# EasyEDA Pro project OV-Watch_V2.4_LCProject_2024-05-25.epro, board Core
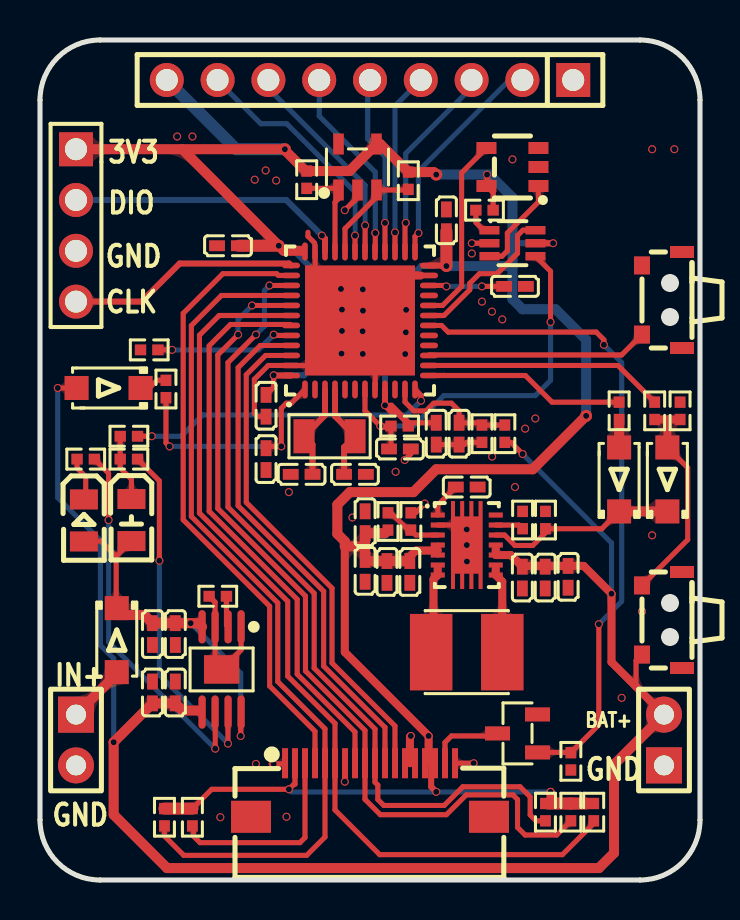
[diagram p4: board, top side]
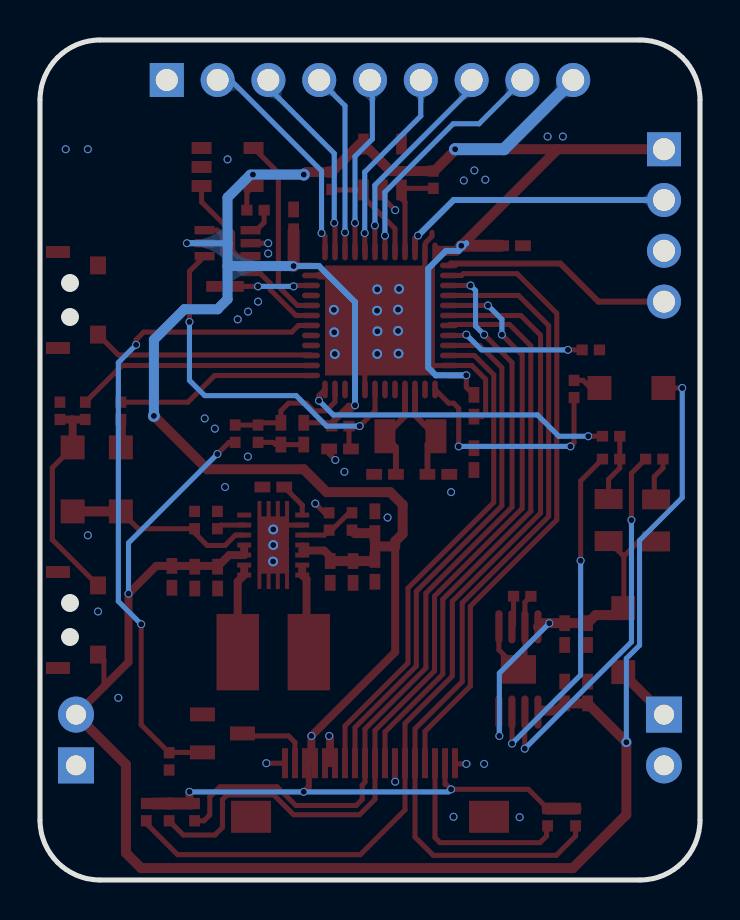
[diagram p5: board, bottom side, seen from below]

Outline 33 x 42 mm; copper layers: Top Layer, Bottom Layer. Coordinates in mm from the lower left corner of the outline.
Outline path: 0,39 0,3 arc(0.88,0.88) 3,0 30,0 arc(32.12,0.88) 33,3 33,39 arc(32.12,41.12) 30,42 3,42 arc(0.88,41.12) 0,39
Stack: Top Layer 0.035mm / Dielectric1 1.51mm FR4 er 4.5 / Bottom Layer 0.035mm

## Design rules (mm)
template: 用户自定义配置
spacing safeClearance (default): track to track 0.152, other pairs 0.152 to 0.3
track width trackWidth (default): min 0.127, default 0.254, max 2.54
differential pair differentialPair (default): width min 0.127, default 0.254, max 2.54; gap min 0.152, default 0.152
via viaSize (default): diameter min 0.4, default 0.4, max 10; hole min 0.3, default 0.3, max 6

## Placement (name value [footprint] x y rotation side)
C1  100nF  [C0402]  11.3 21.05 90 top
C2  100nF  [C0402]  18 21.55 180 top
C3  7pF  [C0402]  13.08 20.28 180 top
C4  7pF  [C0402]  15.75 20.28 0 top
C5  4.7uF  [C0402]  23.75 29.68 0 top
C9  22uF  [C0402]  16.26 17.89 90 top
C10  22uF  [C0402]  18.49 15.4 270 top
C11  22uF  [C0402]  17.35 15.4 270 top
C12  22uF  [C0402]  16.26 15.46 270 top
C13  100nF  [C0402]  21.34 19.65 0 top
C14  10uF  [C0402]  25.26 15.12 270 top
C15  10uF  [C0402]  26.41 15.16 270 top
C16  10uF  [C0402]  24.12 15.12 270 top
C17  10uF  [C0402]  6.77 12.3 270 top
C18  100nF  [C0402]  5.62 12.3 270 top
C19  10uF  [C0402]  5.62 9.38 90 top
C20  100nF  [C0402]  6.77 9.38 90 top
C21  100nF  [C0402]  20.96 22.31 270 top
C22  100nF  [C0402]  11.3 23.71 90 top
C23  100nF  [C0402]  20.32 32.98 270 top
C24  100nF  [C0402]  9.4 31.71 0 top
C25  100nF  [C0402]  19.81 22.31 90 top
D1  1N4007  [SOD-123FL_L2.8-W1.8-LS3.7-RD]  3.43 24.6 180 top
D4  1N4007  [SOD-123FL_L2.8-W1.8-LS3.7-RD]  31.37 20.03 90 top
D5  1N4007  [SOD-123FL_L2.8-W1.8-LS3.7-RD]  28.96 20.03 90 top
D7  A7  [SOD-123FL_L2.8-W1.8-LS3.7-RD]  3.84 11.99 270 top
H1  外接焊盘  [HDR-TH_2P-P2.54-V-M-1]  1.8 7 270 top
H2  外接电池  [HDR-TH_2P-P2.54-V-M-1]  31.2 7 90 top
H4  1125-1104G0S116C001  [HDR-TH_4P-P2.54-V-M-1]  1.8 32.73 270 top
H5  DZ254R-11-09-63  [HDR-TH_9P-P2.54-V-M]  16.5 40 180 top
L2  1.5uH  [IND-SMD_L4.0-W4.0_SWPA4018S]  21.34 11.39 180 top
LED1  SZYY0805R  [LED0805-R-RD]  4.57 18 270 top
LED2  NCD0805G1  [LED0805-R-RD]  2.2 17.98 270 top
R1  10K  [R0402]  6.3 24.55 270 top
R2  10K  [R0402]  17.98 22.7 180 top
R3  10K  [R0402]  5.46 26.51 0 top
R4  4.7K  [R0402]  6.22 3.14 90 top
R5  4.7K  [R0402]  7.62 3.14 90 top
R6  4.7K  [R0402]  27.69 3.39 90 top
R7  4.7K  [R0402]  26.54 3.39 90 top
R8  4.7K  [R0402]  25.27 3.39 90 top
R12  1M  [R0402]  17.4 17.93 270 top
R13  180K  [R0402]  18.54 17.93 270 top
R14  20K  [R0402]  30.73 23.46 90 top
R15  20K  [R0402]  32 23.46 270 top
R16  1M  [R0402]  25.27 18 270 top
R17  4.7K  [R0402]  28.96 23.46 90 top
R18  2K  [R0402]  4.44 21.05 0 top
R19  10K  [R0402]  2.29 21.05 0 top
R20  2K  [R0402]  4.44 22.19 180 top
R22  1.2K  [R0402]  8.89 14.19 180 top
R23  1M  [R0402]  23.24 22.31 270 top
R24  1M  [R0402]  22.1 22.31 90 top
R25  10K  [R0402]  26.54 5.93 90 top
R27  4.7kΩ  [R0402]  18.41 34.96 90 top
R28  4.7kΩ  [R0402]  13.34 35.02 90 top
R29  10K  [R0402]  22.22 33.49 180 top
R30  4.7K  [R0402]  24.13 18 270 top
SW1  -  [KEY-SMD_K2-1806SA-C3DW-04]  31.1 29 90 top
SW2  -  [KEY-SMD_K2-1806SA-C3DW-04]  31.1 13 90 top
U1  STM32F411CEU6  [UFQFPN-48_L7.0-W7.0-P0.50-BL-EP]  16 27.98 0 top
U2  2N7002  [SOT-23-3_L2.9-W1.3-P1.90-LS2.4-BR]  23.88 7.33 0 top
U4  TP4056M  [MSOP-8_L3.0-W3.0-P0.65-LS5.0-BL-EP]  9.08 10.53 180 top
U5  TPS63020DSJR  [VSON-14_L4.0-W3.0-P0.50-BL-EP_TI_DSJ]  21.34 16.75 270 top
U6  BL24C02F-RRRC  [TSOT-23-5_L2.9-W1.6-P0.95-LS2.8-BL]  15.88 35.65 0 top
U8  TPS3823-33DBVR  [SOT-23-5_L3.0-W1.7-P0.95-LS2.8-BR]  23.62 35.65 0 top
U9  BL1551B  [SC-70-6_L2.1-W1.3-P0.65-LS2.3-BR]  23.62 31.84 180 top
X1  -  [OSC-SMD_L3.2-W1.5]  14.48 22.19 0 top
X2  AFC01-S18FCA-00  [FPC-SMD_18P-P0.50_JS_AFC01-S18FCA-00]  16.5 4.5 0 top

## Footprints (pads in the part's own frame, mm; a bottom-side part is the same pattern mirrored in y, then rotated)
C0402
  rect 0.79x0.54 smd: 1(-0.545,0) 2(0.545,0)
FPC-SMD_18P-P0.50_JS_AFC01-S18FCA-00
  rect 0.3x1.5 smd: 1(-4.25,1.339) 2(-3.751,1.339) 3(-3.25,1.339) 4(-2.749,1.339) 5(-2.249,1.339) 6(-1.749,1.339) 7(-1.248,1.339) 8(-0.75,1.339) 9(-0.251,1.339) 10(0.25,1.339) 11(0.75,1.339) 12(1.251,1.339) 13(1.751,1.339) 14(2.251,1.339) 15(2.751,1.339) 16(3.25,1.339) 17(3.75,1.339) 18(4.25,1.339)
  rect 2x1.6 smd: 19(5.949,-1.339) 20(-5.949,-1.339)
HDR-TH_2P-P2.54-V-M-1
  rect 1.8x1.8 hole 1: 1(-1.27,0)
  round 1.8 hole 1: 2(1.27,0)
HDR-TH_4P-P2.54-V-M-1
  rect 1.7x1.7 hole 1.1: 1(-3.81,0)
  round 1.7 hole 1.1: 2(-1.27,0) 3(1.27,0) 4(3.81,0)
HDR-TH_9P-P2.54-V-M
  rect 1.7x1.7 hole 1.1: 1(-10.16,0)
  round 1.7 hole 1.1: 2(-7.62,0) 3(-5.08,0) 4(-2.54,0) 5(0,0) 6(2.54,0) 7(5.08,0) 8(7.62,0) 9(10.16,0)
IND-SMD_L4.0-W4.0_SWPA4018S
  rect 2.123x3.82 smd: 1(1.778,0) 2(-1.778,0)
KEY-SMD_K2-1806SA-C3DW-04
  rect 0.899x0.8 smd: 1(1.73,1.001) 2(-1.73,1.001)
  rect 0.6x1.199 smd: 3(2.401,-1.001) 4(-2.401,-1.001)
LED0805-R-RD
  rect 1x1.399 smd: 1(1.05,0) 2(-1.05,0)
MSOP-8_L3.0-W3.0-P0.65-LS5.0-BL-EP
  oval 0.364x1.662 smd: 1(-0.975,-2.131) 2(-0.325,-2.131) 3(0.325,-2.131) 4(0.975,-2.131) 5(0.975,2.131) 6(0.325,2.131) 7(-0.325,2.131) 8(-0.975,2.131)
  rect 1.76x1.425 smd: 9(0,0)
OSC-SMD_L3.2-W1.5
  rect 1.049x1.7 smd: 1(-1.275,0) 2(1.275,0)
R0402
  rect 0.566x0.54 smd: 1(-0.433,0) 2(0.433,0)
SC-70-6_L2.1-W1.3-P0.65-LS2.3-BR
  rect 1x0.42 smd: 1(1.15,-0.65) 2(1.15,0) 3(1.15,0.65) 4(-1.15,0.65) 5(-1.15,0) 6(-1.15,-0.65)
SOD-123FL_L2.8-W1.8-LS3.7-RD
  rect 1.2x1.2 smd: 1(-1.6,0) 2(1.6,0)
SOT-23-3_L2.9-W1.3-P1.90-LS2.4-BR
  rect 1.25x0.7 smd: 1(1,-0.95) 2(1,0.95) 3(-1,0)
SOT-23-5_L3.0-W1.7-P0.95-LS2.8-BR
  rect 1x0.6 smd: 1(1.3,-0.95) 2(1.3,0) 3(1.3,0.95) 4(-1.3,0.95) 5(-1.3,-0.95)
TSOT-23-5_L2.9-W1.6-P0.95-LS2.8-BL
  rect 0.531x1.044 smd: 1(-0.95,-1.148) 2(0,-1.148) 3(0.95,-1.148) 4(0.95,1.148) 5(-0.95,1.148)
UFQFPN-48_L7.0-W7.0-P0.50-BL-EP
  oval 0.28x0.899 smd: 1(-2.751,-3.45) 2(-2.251,-3.45) 3(-1.75,-3.45) 4(-1.25,-3.45) 5(-0.75,-3.45) 6(-0.249,-3.45) 7(0.249,-3.45) 8(0.75,-3.45) 9(1.25,-3.45) 10(1.75,-3.45) 11(2.251,-3.45) 12(2.751,-3.45) 25(2.751,3.45) 26(2.251,3.45) 27(1.75,3.45) 28(1.25,3.45) 29(0.75,3.45) 30(0.249,3.45) 31(-0.249,3.45) 32(-0.75,3.45) 33(-1.25,3.45) 34(-1.75,3.45) 35(-2.251,3.45) 36(-2.751,3.45)
  oval 0.899x0.28 smd: 13(3.45,-2.751) 14(3.45,-2.251) 15(3.45,-1.75) 16(3.45,-1.25) 17(3.45,-0.75) 18(3.45,-0.249) 19(3.45,0.249) 20(3.45,0.75) 21(3.45,1.25) 22(3.45,1.75) 23(3.45,2.251) 24(3.45,2.751) 37(-3.45,2.751) 38(-3.45,2.251) 39(-3.45,1.75) 40(-3.45,1.25) 41(-3.45,0.75) 42(-3.45,0.249) 43(-3.45,-0.249) 44(-3.45,-0.75) 45(-3.45,-1.25) 46(-3.45,-1.75) 47(-3.45,-2.251) 48(-3.45,-2.751)
  rect 5.499x5.499 smd: 49(0,0)
VSON-14_L4.0-W3.0-P0.50-BL-EP_TI_DSJ
  rect 0.25x0.7 smd: 1(-1.5,-1.45) 2(-1,-1.45) 3(-0.5,-1.45) 4(0,-1.45) 5(0.5,-1.45) 6(1,-1.45) 7(1.5,-1.45) 8(1.5,1.45) 9(1,1.45) 10(0.5,1.45) 11(0,1.45) 12(-0.5,1.45) 13(-1,1.45) 14(-1.5,1.45)
  custom 4.4x1.58 smd: 15(0,0)

## Nets
As in the schematic.

Pads without a net: SW1 3 4; SW2 3 4; U1 2 5 6 10 17 21; U5 14; U8 3

## Via types
v1: diameter 0.6, hole 0.3, Top Layer to Bottom Layer, 3 vias
v2: diameter 0.5, hole 0.3, Top Layer to Bottom Layer, 16 vias
v3: diameter 0.4, hole 0.3, Top Layer to Bottom Layer, 75 vias

## Routing (per net, layer and track width the routed paths; a pad name or vN(x,y) marks a point on that pad's centre or on a via; arc(x,y) is an arc through that point)
3V3: length 153.9
  Top Layer w0.254: 19.43,5.93 19.56,5.81 ; v3(22.35,35.27) 22.35,34.73 U8.5 22.66,34.36 R29.1 ; U5.4 U5.5 ; X2.2 12.75,4.79 12.7,4.79 v3(12.45,4.53) 8.58,4.53 R5.2 ; C22.2 11.68,24.64 v3(11.68,25.24) ; v3(17.25,23.73) 17.58,23.73 18.45,22.86 C25.2
  Top Layer w0.3: 19.56,5.81 19.56,4.66 v3(19.81,4.41) ; R2.1 18.41,22.82 17.91,23.33 17.65,23.33 v3(17.25,23.73) U1.9 ; U1.48 11.69,25.22 v3(11.68,25.24) ; v3(20.32,30.7) 20.29,30.73 U1.24 ; v3(25.65,31.84) U9.5
  Top Layer w0.4: 19.43,5.93 v3(19.43,7.2) 15.24,11.39 15.24,16.68 ; 25.4,3.83 25.53,3.95 v3(25.53,4.41) ; C10.1 18.49,16.17 18.8,16.47 19.87,16.47 19.89,16.49
  Top Layer w0.5: 16.26,16.68 C12.1 ; 16.26,16.68 C9.1 17.25,17.34 R12.2 ; 16.26,16.68 15.24,16.68 15.24,16.93 14.87,17.31 14.87,18.77 15.49,19.39 18.67,19.39 19.81,20.54 24.64,20.54 v1(27.31,23.2) ; 13.08,31.46 12.19,31.46 v2(11.94,31.71) 7.11,36.54 ; 7.11,36.54 H4.1 ; 7.11,36.54 v1(12.24,36.54) 12.24,36.49 13.28,35.45 R28.2 15.47,35.45 U6.4 17.01,36.8 R27.2 19.69,35.4 v1(19.81,35.27) ; C10.1 C11.1 16.33,15.95 16.26,16.02
  Top Layer w0.6: v3(20.32,30.7) C23.2 ; 9.94,31.71 v2(11.94,31.71) ; R4.2 R5.2 ; 27.31,3.83 R7.2 25.4,3.83
  Bottom Layer w0.254: v3(12.45,4.53) 12.57,4.41 v3(19.81,4.41) v3(25.53,4.41)
  Bottom Layer w0.3: v3(25.65,31.84) 23.63,31.84 23.62,31.84 ; 11.68,31.84 12.06,31.46 12.7,31.46 13.59,30.57 13.59,25.62 13.21,25.24 v3(11.68,25.24) ; v3(17.25,23.73) 17.25,28.9 19.05,30.7 v3(20.32,30.7)
  Bottom Layer w0.5: v1(19.81,35.27) 22.48,35.27 23.62,34.13 23.62,30.7 ; 23.62,30.7 23.62,29.04 24.12,28.54 25.78,28.54 27.31,27.01 v1(27.31,23.2) ; 23.62,30.7 20.32,30.7
  Bottom Layer w0.6: v1(12.24,36.54) 9.8,36.54 H5.9
GND: length 26.3
  Top Layer w0.254: X2.18 v3(21.68,5.84) 21.72,5.81 ; 16.71,25.54 16.76,25.49 16.76,24.52 ; 20.07,21.77 21.22,21.77 21.34,21.88 R24.1 ; 13.76,31.43 13.76,30.43 13.71,30.38 ; v3(18.24,21) 18.54,21.31 C2.1 ; 15.25,5.84 15.24,5.83 v3(15.24,4.92) ; X2.14 18.25,5.84 ; 12.54,25.73 11.41,25.73 10.72,25.03 10.72,23.33 10.88,23.17 C22.1 ; 12.54,25.73 U1.47 ; 12.54,25.73 13.44,25.72 13.46,25.7 ; U5.2 20.63,17.75 20.69,17.81 ; 13.73,31.85 13.4,32.19 13.4,32.39 ; R13.1 18.77,18.36 v3(19.24,18.82) ; U6.2 15.88,34.13 v3(15.24,33.49) ; 11.56,5.81 12.22,5.81 X2.1 ; R22.2 8.75,13.89 U4.3 8.75,10.85 U4.9 10.05,11.5 U4.1 ; U9.2 v3(21.59,31.84)
  Top Layer w0.4: 18.5,5.84 18.5,7.16 v3(18.54,7.2) ; 18.52,30.23 19.03,30.23
  vias: v2(15.05,29.55) v2(15.1,28.52) v2(15.1,27.45) v2(15.08,26.32) v2(16.14,29.53) v2(16.15,28.47) v2(16.13,27.44) v2(16.14,26.3) v2(18.31,28.51) v2(18.29,27.39) v2(18.26,26.3) v2(21.34,17.53) v2(21.34,16.75) v2(21.35,15.92) v3(6.86,37.17) v3(7.62,37.17) v3(9.02,3.14) v3(10.74,35.02) v3(10.79,5.81) v3(11.28,35.48) v3(11.68,5.81) v3(11.81,34.97) v3(12.32,3.16) v3(12.45,19.39) v3(15.62,18.12) v3(17.78,20.41) v3(21.59,31.33) v3(22.1,28.92) v3(22.6,28.42) v3(22.61,21.17) v3(23.11,28.03) v3(23.62,36.03) v3(23.75,19.65) v3(24.26,22.57) v3(24.76,23.08) v3(29.08,9.11) v3(30.1,13.42) v3(30.61,36.54) v3(30.61,17.23) v3(31.72,36.54)
VBAT: length 12.4
  Top Layer w0.254: R1.2 6.3,21.86 v3(6.48,21.68) ; C1.2 11.39,21.68 v3(12.06,21.68) 12.06,23.58 12.32,23.84 12.56,23.84 U1.1
  Bottom Layer w0.254: v3(6.48,21.68) v3(12.06,21.68)
VBUS: length 18.3
  Top Layer w0.254: v3(10.03,7.2) 10.03,8.38 U4.8 ; 3.81,16.18 3.05,16.95 2.29,16.95 ; 3.81,16.18 3.81,13.25 ; 3.81,16.18 LED1.1
  Top Layer w0.5: 3.81,13.25 5.22,13.25 C18.1 C17.1 v3(7.53,12.84) 7.92,12.84 U4.4
  Bottom Layer w0.254: v3(10.03,7.2) 10.03,10.34 v3(7.53,12.84)
VIN: length 2.8
  Top Layer w0.5: H1.1 3.81,10.28
#WDOG_EN: length 7.8
  Top Layer w0.254: U9.6 24.15,32.49 23.88,32.22 23.88,31.33 22.86,30.32 21.97,30.32 21.49,29.83 21.49,29.51 20.2,28.22 U1.19
BAT: length 88.9
  Top Layer w0.254: v3(0.89,24.6) 1.96,24.6 ; v3(24.13,21.3) 23.55,21.88 R23.2 ; SW2.2 29.8,10.97 29.8,9.67
  Top Layer w0.4: H2.2 28.57,10.89 v3(28.57,14.31) 27.19,15.7 C15.1 24.16,15.7 24.12,15.67 23.54,16.25 U5.10 22.79,16.6
  Top Layer w0.5: H2.2 28.7,5.77 28.7,1.35 27.95,0.6 6.35,0.6 3.68,3.27 v2(3.68,6.89) C19.1 C20.1 7.12,8.47 7.87,8.47
  Bottom Layer w0.254: v3(24.13,21.3) 28.57,16.85 v3(28.57,14.31) ; v2(3.68,6.89) 3.68,11.07 3.02,11.73 3.02,16.98 0.89,19.11 v3(0.89,24.6)
BAT_DET: length 6.8
  Top Layer w0.254: U1.11 18.25,23.9 18.69,23.46 19.3,23.46 19.69,23.84 20.57,23.84 20.96,23.46 C21.1 21.99,22.86 R24.2 R23.1
BLE_EN: length 9.7
  Top Layer w0.254: v3(16.76,32.35) 16.76,31.44 U1.29
  Bottom Layer w0.254: H5.6 13.96,38.2 16.76,35.4 v3(16.76,32.35)
CHARG: length 15.6
  Top Layer w0.254: R20.1 v3(5.59,22.19) ; v3(19.05,23.97) 19.05,24.23 U1.12
  Bottom Layer w0.254: v3(19.05,23.97) 18.34,23.25 8.12,23.25 7.06,22.19 v3(5.59,22.19)
KEY1: length 11.1
  Top Layer w0.254: SW1.2 29.08,26.25 19.48,26.25 U1.15
LCD_BLK: length 32.8
  Top Layer w0.254: v3(27.94,12.79) 27.94,7.76 26.54,6.36 26.53,6.38 24.88,6.38 ; v3(28.19,26.76) 28.19,27.01 27.81,27.39 20.41,27.39 20.08,27.73 U1.18
  Bottom Layer w0.254: v3(27.94,12.79) 29.08,13.93 29.08,25.87 v3(28.19,26.76)
LCD_CLK: length 40.9
  Top Layer w0.254: v3(10.79,27.27) 9.4,25.87 9.4,18.64 13.71,14.34 13.71,10.59 16.75,7.55 X2.10 16.75,4.89 16.89,4.75 16.89,4.03 17.19,3.73 20.21,3.73 21.14,4.66 24,4.66 24.51,4.15 24.51,3.25 24.8,2.96 25.27,2.96 ; v3(11.47,29.73) U1.39
  Bottom Layer w0.254: v3(11.47,29.73) 11.22,29.47 11.22,27.69 v3(10.79,27.27)
LCD_CS: length 25.9
  Top Layer w0.254: X2.11 17.25,7.63 14.18,10.69 14.18,14.43 9.91,18.71 9.91,25.62 11.02,26.73 U1.45
LCD_DC: length 25.1
  Top Layer w0.254: 17.75,5.84 17.75,7.7 14.6,10.85 14.6,14.59 10.31,18.88 10.31,25.26 11.28,26.23 U1.46
LCD_MOSI: length 43.4
  Top Layer w0.254: v3(9.91,27.27) 8.89,26.25 8.89,18.58 13.27,14.19 13.27,10.45 16.25,7.48 X2.9 16.25,4.03 17.02,3.27 20.32,3.27 21.31,4.26 23.65,4.26 23.88,4.03 23.88,2.63 24.26,2.25 25.83,2.25 26.54,2.96 ; U1.41 v3(10.6,28.73)
  Bottom Layer w0.254: v3(9.91,27.27) 9.91,28.03 v3(10.6,28.73)
LCD_RST: length 28.4
  Top Layer w0.254: X2.8 15.75,7.4 12.86,10.29 12.86,14.03 8.46,18.44 8.46,26.71 9.53,27.78 12.5,27.78 U1.43
LED_EN: length 9
  Top Layer w0.254: U1.28 v3(17.25,32.86)
  Bottom Layer w0.254: H5.5 16.38,39.88 16.38,37.05 17.25,36.18 v3(17.25,32.86)
OSC32IN: length 4.9
  Top Layer w0.3: C3.1 13.63,21.77 X1.1 14.25,23.23 U1.3
OSC32OUT: length 4.9
  Top Layer w0.3: C4.1 15.2,21.64 X1.2 14.75,23.19 U1.4
POWER_EN: length 10.1
  Top Layer w0.254: 20.18,25.22 24.27,25.22 25.6,23.89 R17.2 ; 20.18,25.22 20.19,25.24 ; 20.18,25.22 U1.13
PROM_SCL: length 4.8
  Top Layer w0.254: R28.1 14.84,34.58 U6.1 14.93,34.06 14.75,33.89 U1.33
PROM_SDA: length 5.3
  Top Layer w0.254: R27.1 18.39,34.5 U6.3 16.82,34.14 15.25,32.57 U1.32
RST: length 19.9
  Top Layer w0.254: U9.4 25.53,30.44 v3(25.53,27.9) ; C2.2 17.55,21.65 17.55,22.7 17.15,22.7 ; 17.15,22.7 17.21,22.63 ; 17.15,22.7 17.01,22.7 16.25,23.46 U1.7
  Bottom Layer w0.254: v3(25.53,27.9) 25.53,24.98 24.76,24.22 20.19,24.22 18.67,22.7 v3(17.02,22.7)
SENSOR_INT: length 11.2
  Top Layer w0.254: v3(18.92,32.35) 18.75,32.18 U1.25
  Bottom Layer w0.254: H5.2 23.47,40 18.92,35.45 v3(18.92,32.35)
SENSOR_SCL: length 9.1
  Top Layer w0.254: v3(17.75,32.38) U1.27
  Bottom Layer w0.254: v3(17.75,32.38) 17.75,38.71 H5.4
SENSOR_SDA: length 10
  Top Layer w0.254: U1.26 18.25,32.82 v3(18.29,32.86)
  Bottom Layer w0.254: H5.3 21.58,39.62 18.29,36.33 v3(18.29,32.86)
SWCLK: length 11.6
  Top Layer w0.3: H4.4 5.08,28.92 6.99,30.82 12.45,30.82 U1.37
SWDIO: length 13.9
  Top Layer w0.3: v3(14.1,32.22) 14.25,32.07 U1.34
  Bottom Layer w0.3: H4.2 12.32,34 v3(14.1,32.22)
TP_INT: length 10.1
  Top Layer w0.254: X2.3 13.25,2.12 13,1.87 8,1.87 7.67,2.2 7.67,2.65 R5.1
TP_RST: length 31.5
  Top Layer w0.254: X2.4 13.75,7.43 11.48,9.7 11.48,13.69 7.16,18.01 7.16,28.33 9.14,30.32 11.83,30.32 11.92,30.23 U1.38
TP_SCL: length 46.2
  Top Layer w0.254: 27.69,2.96 27.69,2.83 26.12,1.27 16.98,1.27 14.75,3.5 14.75,7.83 12.38,10.19 12.38,13.93 7.97,18.35 7.97,27.24 8.96,28.22 U1.42
TP_SDA: length 43.3
  Top Layer w0.254: R4.1 6.22,2.2 7.19,1.23 13.34,1.23 14.25,2.15 X2.5 14.25,7.56 11.89,9.92 11.89,13.86 7.57,18.18 7.57,27.72 9.07,29.23 U1.40
TPS_EN: length 9.6
  Top Layer w0.254: U5.12 23.23,17.25 23.75,16.73 24.64,16.73 25.27,17.36 R16.2 28.09,17.56 D5.1
  Top Layer w0.5: D5.1 D4.1
USART1_RX: length 12.2
  Top Layer w0.254: U1.31 v3(15.75,32.22) 15.75,32.22
  Bottom Layer w0.254: v3(15.75,32.22) 15.76,32.22 15.76,34.39 12.34,37.81 11.05,37.81 8.88,39.98 H5.8
USART1_TX: length 10.6
  Top Layer w0.254: U1.30 16.26,31.43 v3(16.26,32.73)
  Bottom Layer w0.254: v3(16.26,32.73) 16.26,32.73 16.26,34.74 11.42,39.58 H5.7
WAKE: length 12
  Top Layer w0.254: R14.2 28.9,25.73 U1.14
WDI: length 9.5
  Top Layer w0.254: U1.20 20.13,28.73 21.08,29.68 21.08,35.36 U8.4
$1N9198: length 1.4
  Top Layer w0.254: R1.1 5.85,24.98 5.47,24.6 D1.1
$1N10420: length 6.7
  Top Layer w0.254: v3(6.6,26.51) 6.15,26.51 ; U1.44 11.73,27.23 v3(11.68,27.27)
  Bottom Layer w0.254: v3(11.68,27.27) 10.92,26.51 v3(6.6,26.51)
$1N10586: length 3.8
  Top Layer w0.254: U1.22 20.28,29.73 v3(20.32,29.68) ; v3(22.1,29.68) C5.1
  Bottom Layer w0.254: v3(22.1,29.68) v3(20.32,29.68)
$1N12310: length 3.9
  Top Layer w0.254: X2.17 20.25,6.88 20.57,7.2 22.75,7.2 U2.3
$1N19622: length 2.9
  Top Layer w0.254: R12.1 17.54,18.36 18.41,17.49 R13.2 18.79,17.25 U5.3
$1N22333: length 4.3
  Top Layer w0.4: 19.67,11.39 19.67,15.03 U5.7 19.89,15.58
$1N22702: length 4.3
  Top Layer w0.4: L2.2 23.11,14.92 U5.8 22.79,15.58
$1N25828: length 10.9
  Top Layer w0.254: D4.2 32.38,20.61 32.38,17.02 SW2.1
  Top Layer w0.4: 31.4,23.03 31.37,23 D4.2 ; 31.4,23.03 R14.1 ; 31.4,23.03 R15.2
$1N34059: length 1.4
  Top Layer w0.5: R17.1 D5.2
$1N35112: length 18.8
  Top Layer w0.254: U4.6 8.76,8.39 v3(8.76,6.57) ; R19.2 3.43,20.33 v3(3.43,18)
  Bottom Layer w0.254: v3(3.43,18) 3.43,11.9 v3(8.76,6.57)
$1N35199: length 17.7
  Top Layer w0.254: v3(9.4,6.82) 9.4,8.39 U4.7 ; v3(5.97,15.97) 5.97,19.95 R18.2
  Bottom Layer w0.254: v3(9.4,6.82) 5.97,10.25 v3(5.97,15.97)
$1N35744: length 3.4
  Top Layer w0.254: LED1.2 4.57,20.04 4.01,20.6 R18.1 R20.2
$1N36410: length 2.2
  Top Layer w0.254: R19.1 1.85,20.6 2.29,20.16 2.29,19.05
$1N37898: length 1.7
  Top Layer w0.254: U4.2 9.32,12.74 9.32,14.31
$1N149362: length 4.9
  Top Layer w0.254: U8.1 24.92,33.9 23.37,32.35 23.37,31.46 23.1,31.19 U9.3
$1N149393: length 1.5
  Top Layer w0.254: R29.2 21.79,33.49 21.79,32.88 22.18,32.49 U9.1
$1N188625: length 1.4
  Top Layer w0.254: U5.13 23.95,17.75 R30.2
$1N188630: length 1.8
  Top Layer w0.254: C13.1 19.89,18.75 U5.1

## Copper pours and planes (outline as drawn; the poured copper is in the pictures)
GND on Top Layer: -6.48,47.84 39.88,47.84 39.88,-7.02 -6.48,-7.02
GND on Bottom Layer: -6.48,47.84 39.88,47.84 39.88,-7.02 -6.48,-7.02

Small or netless copper shapes (teardrops, artwork), in the pictures only: 250 on Top Layer, 54 on Bottom Layer

## Text on the board
Top Silkscreen Layer: BAT+ | GND | IN+ | CLK | 3V3 | DIO
